# Altium schematic sheet Deneigus_POWER.SchDoc
size Tabloid; Sheet_Name: Power tree; Size: 11x17
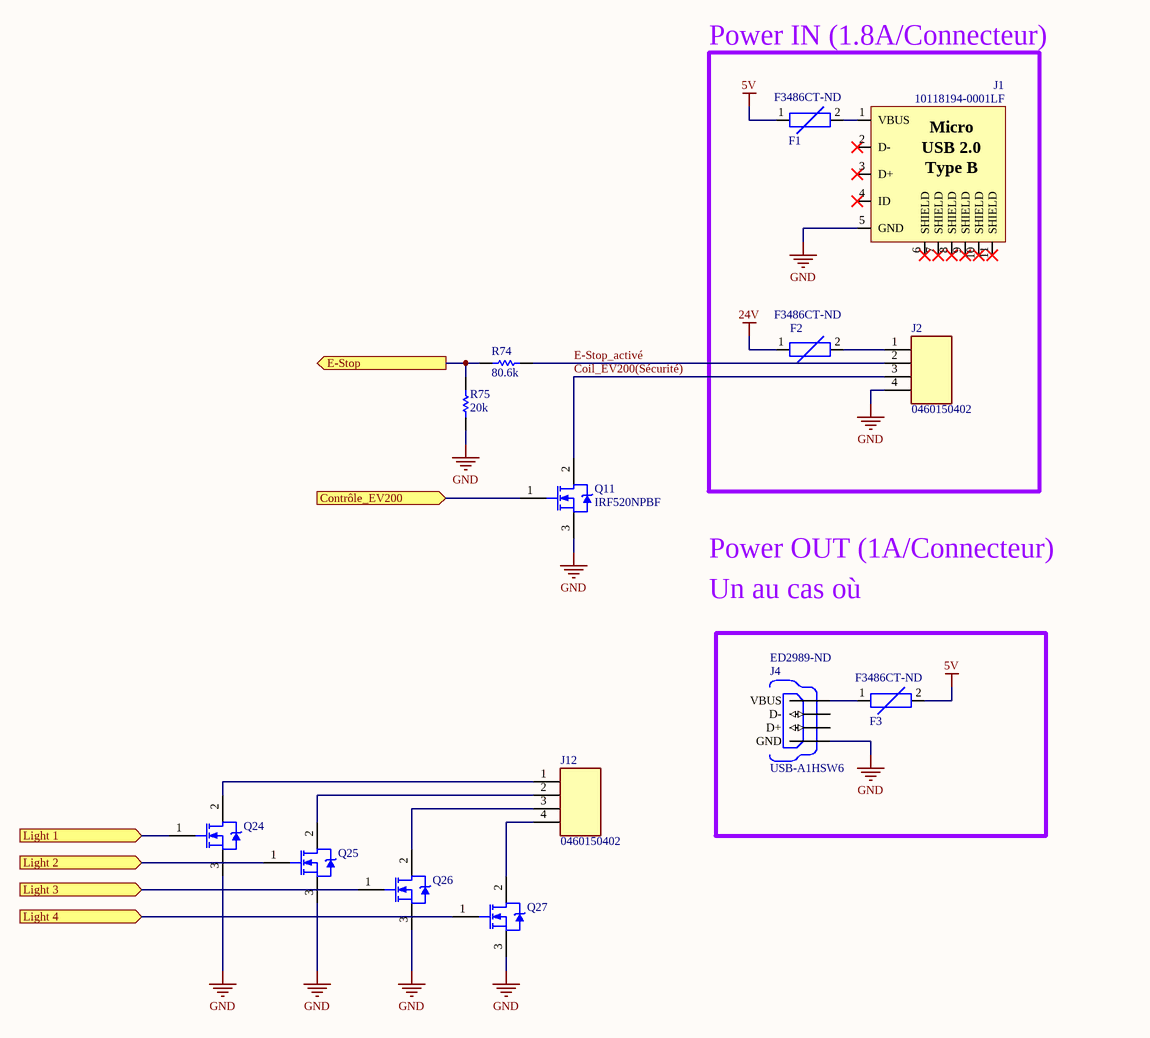
[diagram p0: Deneigus_POWER.SchDoc]

## Parts
F1  Supplier Part Number 1: F3486CT-ND  [1812 (4532 Metric)]  (hidden comment: 0ZCG0075BF2B)
F2  Supplier Part Number 1: F3486CT-ND  [1812 (4532 Metric)]  (hidden comment: 0ZCG0075BF2B)
F3  Supplier Part Number 1: F3486CT-ND  [1812 (4532 Metric)]  (hidden comment: 0ZCG0075BF2B)
J1  10118194-0001LF  [CON_USB_10118194-0001LF]
J2  0460150402  [Molex_4PIN]
J4  USB-A1HSW6  Supplier Part Number 1: ED2989-ND  [OST_USB-A1HSW6]
J12  0460150402  [Molex_4PIN]
Q11  IRF520NPBF  [INTR-TO-220AB-3]
Q24  IRF520NPBF  [INTR-TO-220AB-3]  (value not drawn)
Q25  IRF520NPBF  [INTR-TO-220AB-3]  (value not drawn)
Q26  IRF520NPBF  [INTR-TO-220AB-3]  (value not drawn)
Q27  IRF520NPBF  [INTR-TO-220AB-3]  (value not drawn)
R74  value 80.6k  [RES_0805]  (hidden comment: Res1)
R75  value 20k  [RES_0805]  (hidden comment: Res1)

## Blocks framed on the sheet
Power IN (1.8A/Connecteur): F1 F2 J1 J2

## Ports
Contrôle_EV200 (in), E-Stop (out), Light 1 (in), Light 2 (in), Light 3 (in), Light 4 (in)

## Nets
5V: F1.1 F3.2
24V: F2.1
GND: J1.5(GND) J2.4 J4.4(GND) Q11.3(S) Q24.3(S) Q25.3(S) Q26.3(S) Q27.3(S) R75.2
Coil_EV200(Sécurité): J2.3 Q11.2(D)
Contrôle_EV200: Q11.1(G) ; port Contrôle_EV200
E-Stop: R74.2 R75.1 ; port E-Stop
E-Stop_activé: J2.2 R74.1
Light 1: Q24.1(G) ; port Light 1
Light 2: Q25.1(G) ; port Light 2
Light 3: Q26.1(G) ; port Light 3
Light 4: Q27.1(G) ; port Light 4
NetF1_2: F1.2 J1.1(VBUS)
NetF2_2: F2.2 J2.1
NetF3_1: F3.1 J4.1(VBUS)
NetJ12_1: J12.1 Q24.2(D)
NetJ12_2: J12.2 Q25.2(D)
NetJ12_3: J12.3 Q26.2(D)
NetJ12_4: J12.4 Q27.2(D)

Not connected (* = marked no-connect by the designer): J1 2(D-)* 3(D+)* 4(ID)* 6(SHIELD)* 7(SHIELD)* 8(SHIELD)* 9(SHIELD)* 10(SHIELD)* 11(SHIELD)*; J4 2(D-) 3(D+)

## Notes on the sheet
- Power OUT (1A/Connecteur)
- Un au cas où
- Sheet Name
- Project Title
- Global Project
- Size
- Group
- Revision
- Date
- Sheet
- of
- Filename
- Designers
- (in symbol CON_USB_10118194-0001LF) Micro; USB 2.0; Type B

## Library data of the parts
F1-F3 = PTC 33V 750 mA: Max Voltage: 33V; Hold Current: 750mA; Supplier 1: Digi-Key
J1 = CON_USB_10118194-0001LF: CON - USB MICRO B RECPT SMT R/A - 4PIN; Manufacturer #1: Amphenol FCI; Value: USB - Micro B; Voltage Rating: 100VAC; Current Rating: 1.8A; GRAMS Lib Spec: 2.8; Magnetic Material: YES; Cryo: UNKNOWN; Tolerance: *; Power Max: *; HelpURL: https://cdn.amphenol-icc.com/media/wysiwyg/files/drawing/10118194.pdf; CreatedBy/Date: Arnaud Samson - 09/07/18; VerifiedBy: Jonathan Bouchard 2018-07-12; Temperature: -30°C ~ 80°C; Package: 5-SMD; Manufacturer #2: *; Note: *; Assembly Type: SMD; Part Number #2: *; Part Number #1: 10118194-0001LF; Polarized: YES; Supplier 1: Digi-Key; Supplier Part Number 1: 609-4618-1-ND
J2 J12 = Molex_4PIN: Supplier 1: Digi-Key; Supplier Part Number 1: WM3844-ND
J4 = USB-A1HSW6: USB-A _USB TYPE-A_  Receptacle Connector 4 Position Through Hole, Right Angle; MF: On Shore; SnapEDA_Link: https://www.snapeda.com/parts/USB-A1HSW6/On%20Shore%20Technology%20Inc./view-part/13110/?ref=snap; Package: None; MP: USB-A1HSW6; Availability: Unavailable; Price: None; Value: *; Supplier 1: Digi-Key
Q11 Q24-Q27 = CMP-013-00017-4: HEXFET(R) Power MOSFET, 100 V, 9.7 A, 0.2 Ohm, -55 to 175 degC, 3-Pin FM (TO-220AB), RoHS, Tube; Manufacturer: International Rectifier; Power: 48W; Elements: 1; Typical Rise Time: 23ns; Nominal Dual Supply Voltage: 100V; Rds On Max: 200mohm; Input Capacitance: 330pF; Nominal Vgs: 4V; Package Reference: TO-220AB; Max Operating Temperature: 175°C; Datasheet Version: Nov-03; Datasheet URL: http://www.infineon.com/dgdl/irf520npbf.pdf?fileId=5546d462533600a4015355e340711985; Package Quantity: 50; Package Description: 3-Pin Flange Mount, Body 4.445 x 10.415 mm, Pitch 2.54 mm; Pins: 3; Packaging: Rail/Tube; RoHS Compliant: True; Min Operating Temperature: -55°C; Case/Package: TO-220-3; Mounting Technology: TH
R74 R75 = Res1: Resistor; Published: 8-Jun-2000; LatestRevisionDate: 17-Jul-2002; LatestRevisionNote: Re-released for DXP Platform.; PackageReference: AXIAL-0.3; Publisher: Altium Limited; PackageDescription: Axial Device, Thru-Hole; 2 Leads; 0.3 in Pin Spacing